# Altium schematic sheet RSD_M1_HELMET_UNIT_MCU_STOP_LIGHT_V2.SchDoc
size A4
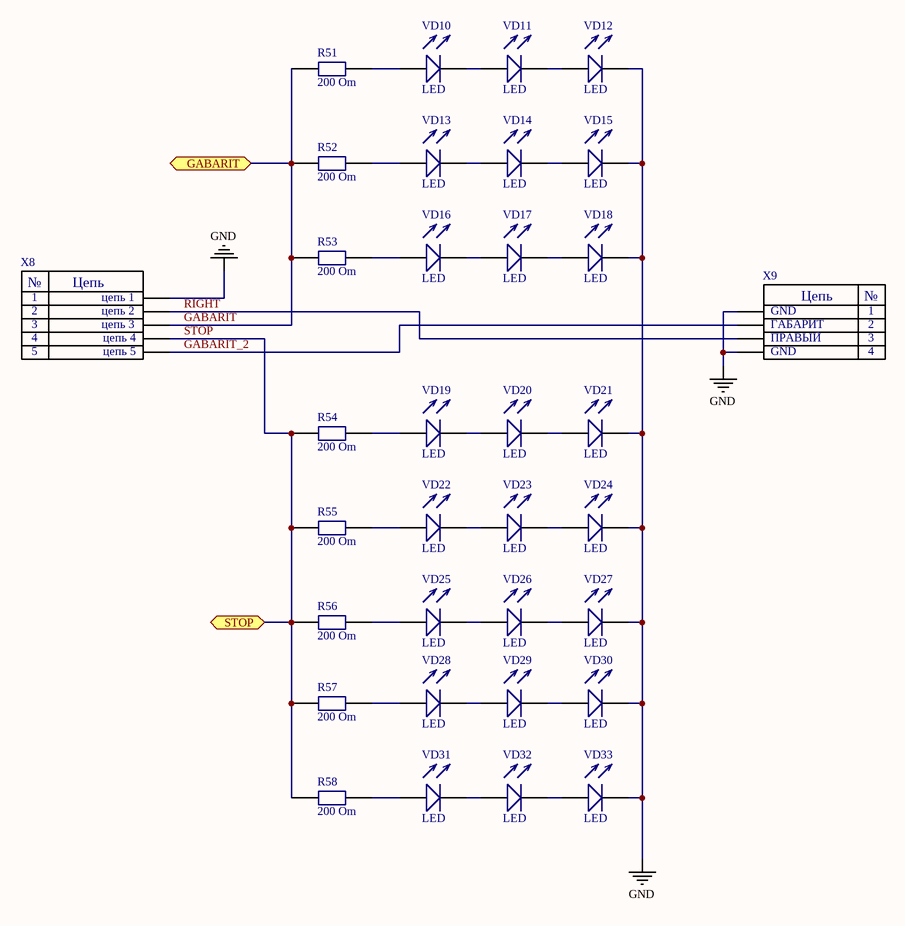
[diagram p0: RSD_M1_HELMET_UNIT_MCU_STOP_LIGHT_V2.SchDoc]

## Parts
R51  value 200 Om  [Res0603]  (hidden comment: Resistor)
R52  value 200 Om  [Res0603]  (hidden comment: Resistor)
R53  value 200 Om  [Res0603]  (hidden comment: Resistor)
R54  value 200 Om  [Res0603]  (hidden comment: Resistor)
R55  value 200 Om  [Res0603]  (hidden comment: Resistor)
R56  value 200 Om  [Res0603]  (hidden comment: Resistor)
R57  value 200 Om  [Res0603]  (hidden comment: Resistor)
R58  value 200 Om  [Res0603]  (hidden comment: Resistor)
VD10  LED  [3528_LED]
VD11  LED  [3528_LED]
VD12  LED  [3528_LED]
VD13  LED  [3528_LED]
VD14  LED  [3528_LED]
VD15  LED  [3528_LED]
VD16  LED  [3528_LED]
VD17  LED  [3528_LED]
VD18  LED  [3528_LED]
VD19  LED  [3528_LED]
VD20  LED  [3528_LED]
VD21  LED  [3528_LED]
VD22  LED  [3528_LED]
VD23  LED  [3528_LED]
VD24  LED  [3528_LED]
VD25  LED  [3528_LED]
VD26  LED  [3528_LED]
VD27  LED  [3528_LED]
VD28  LED  [3528_LED]
VD29  LED  [3528_LED]
VD30  LED  [3528_LED]
VD31  LED  [3528_LED]
VD32  LED  [3528_LED]
VD33  LED  [3528_LED]
X8  1: цепь 1  2: цепь 2  3: цепь 3  4: цепь 4  5: цепь 5  [FPC_5_1]  (hidden comment: FPC_connector_5_1)
X9  1: GND  2: ГАБАРИТ  3: ПРАВЫЙ  [FPC_4_1]  (hidden comment: FPC_connector_4_1)

## Ports
GABARIT, STOP

## Nets
GND: VD12.1 VD15.1 VD18.1 VD21.1 VD24.1 VD27.1 VD30.1 VD33.1 X8.1 X9.1 X9.4
GABARIT: R51.2 R52.2 R53.2 X8.3 ; port GABARIT
GABARIT_2: X8.5 X9.2
RIGHT: X8.2 X9.3
STOP: R54.2 R55.2 R56.2 R57.2 R58.2 X8.4 ; port STOP
NetR51_1: R51.1 VD10.2
NetR52_1: R52.1 VD13.2
NetR53_1: R53.1 VD16.2
NetR54_1: R54.1 VD19.2
NetR55_1: R55.1 VD22.2
NetR56_1: R56.1 VD25.2
NetR57_1: R57.1 VD28.2
NetR58_1: R58.1 VD31.2
NetVD10_1: VD10.1 VD11.2
NetVD11_1: VD11.1 VD12.2
NetVD13_1: VD13.1 VD14.2
NetVD14_1: VD14.1 VD15.2
NetVD16_1: VD16.1 VD17.2
NetVD17_1: VD17.1 VD18.2
NetVD19_1: VD19.1 VD20.2
NetVD20_1: VD20.1 VD21.2
NetVD22_1: VD22.1 VD23.2
NetVD23_1: VD23.1 VD24.2
NetVD25_1: VD25.1 VD26.2
NetVD26_1: VD26.1 VD27.2
NetVD28_1: VD28.1 VD29.2
NetVD29_1: VD29.1 VD30.2
NetVD31_1: VD31.1 VD32.2
NetVD32_1: VD32.1 VD33.2

## Notes on the sheet
- (in symbol FPC_connector_4_1) Цепь; №
- (in symbol FPC_connector_5_1) №; Цепь

## Library data of the parts
X9 = FPC_connector_4_1: Value: 0522070433; 4: GND
VD10-VD33 = LED: Value: LED